# Altium project BMS Slave V0.1.PrjPcb (part 1 of 3)
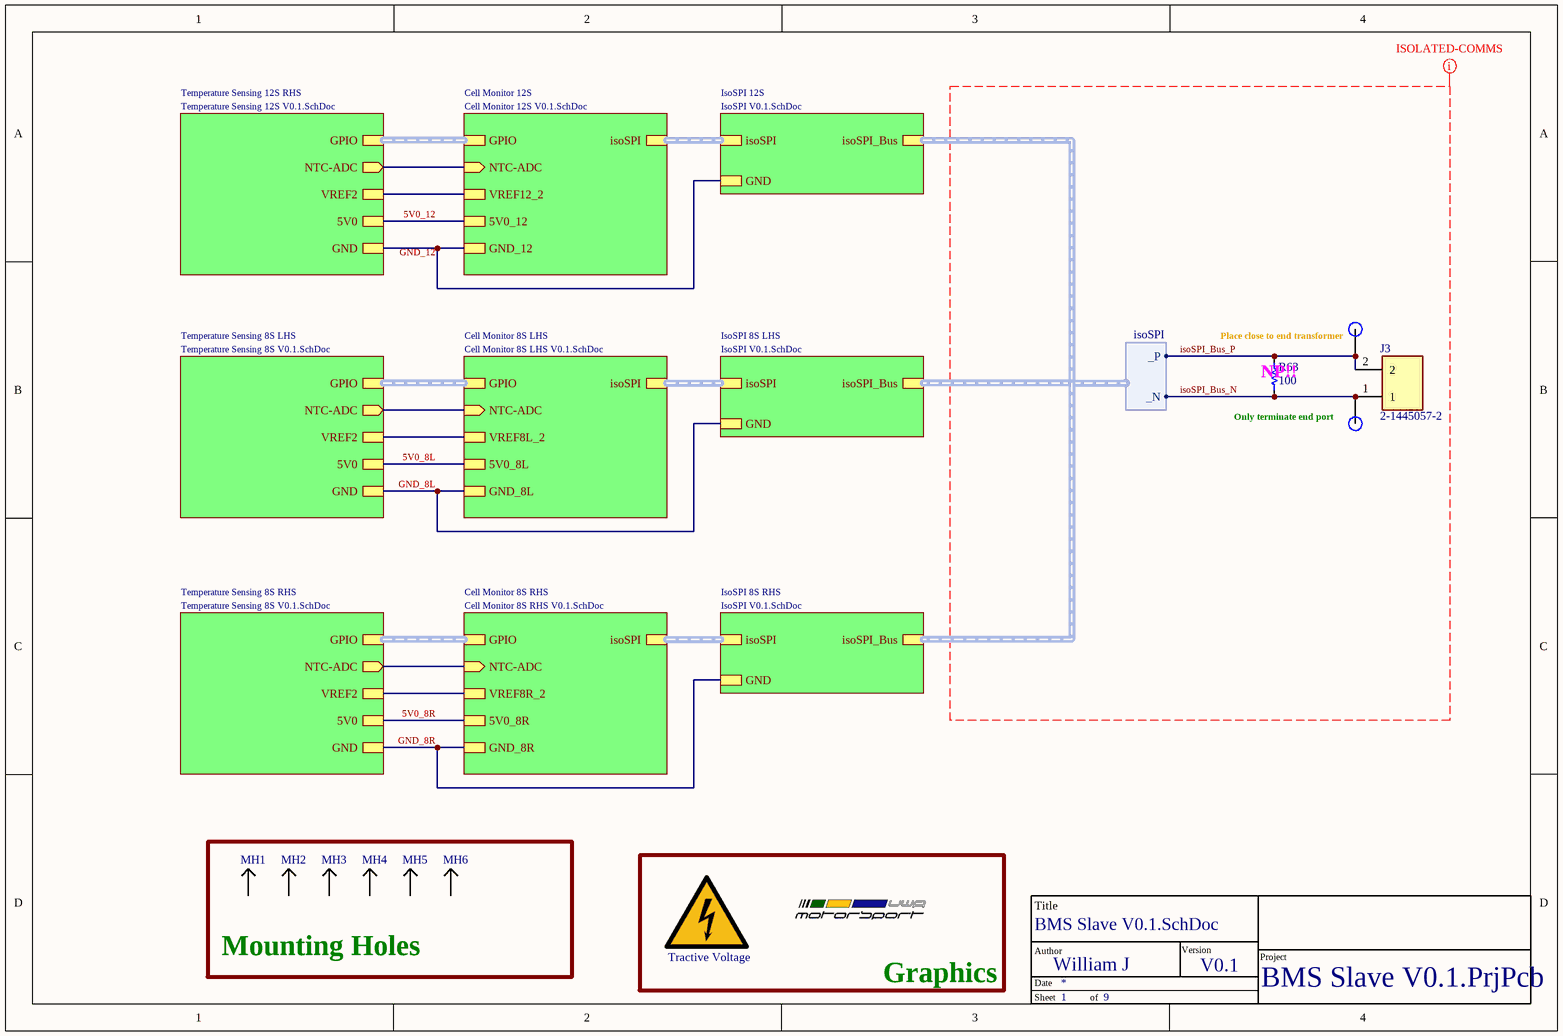
[diagram p0: BMS Slave V0.1.SchDoc]
ProAuthor: William J; ProjectTitle: HV BMS Slave; Version: V0.1
9 sheets, 600 parts. Net scope: strictly hierarchical (ports join the sheet entries above them; power ports are local).
Board file: BMS Slave V0.1.PcbDoc
Sheets:
  BMS Slave V0.1.SchDoc
    Cell Monitor 12S = Cell Monitor 12S V0.1.SchDoc
      Balance Circuit 121 = Balance V0.1.SchDoc
      Balance Circuit 122 = Balance V0.1.SchDoc
      Balance Circuit 123 = Balance V0.1.SchDoc
      Balance Circuit 124 = Balance V0.1.SchDoc
      Balance Circuit 125 = Balance V0.1.SchDoc
      Balance Circuit 126 = Balance V0.1.SchDoc
      Balance Circuit 127 = Balance V0.1.SchDoc
      Balance Circuit 128 = Balance V0.1.SchDoc
      Balance Circuit 129 = Balance V0.1.SchDoc
      Balance Circuit 1210 = Balance V0.1.SchDoc
      Balance Circuit 1211 = Balance V0.1.SchDoc
      Balance Circuit 1212 = Balance V0.1.SchDoc
    IsoSPI 12S = IsoSPI V0.1.SchDoc
    Cell Monitor 8S LHS = Cell Monitor 8S LHS V0.1.SchDoc
      Balance Circuit 8L1 = Balance V0.1.SchDoc
      Balance Circuit 8L2 = Balance V0.1.SchDoc
      Balance Circuit 8L3 = Balance V0.1.SchDoc
      Balance Circuit 8L4 = Balance V0.1.SchDoc
      Balance Circuit 8L5 = Balance V0.1.SchDoc
      Balance Circuit 8L6 = Balance V0.1.SchDoc
      Balance Circuit 8L7 = Balance V0.1.SchDoc
      Balance Circuit 8L8 = Balance V0.1.SchDoc
    Temperature Sensing 8S LHS = Temperature Sensing 8S V0.1.SchDoc
      NTC Sense 8S1 = NTC Sense V0.1.SchDoc
      NTC Sense 8S2 = NTC Sense V0.1.SchDoc
      NTC Sense 8S3 = NTC Sense V0.1.SchDoc
      NTC Sense 8S4 = NTC Sense V0.1.SchDoc
      NTC Sense 8S5 = NTC Sense V0.1.SchDoc
      NTC Sense 8S6 = NTC Sense V0.1.SchDoc
      NTC Sense 8S7 = NTC Sense V0.1.SchDoc
      NTC Sense 8S8 = NTC Sense V0.1.SchDoc
      NTC Sense 8S9 = NTC Sense V0.1.SchDoc
      NTC Sense 8S10 = NTC Sense V0.1.SchDoc
      NTC Sense 8S11 = NTC Sense V0.1.SchDoc
      NTC Sense 8S12 = NTC Sense V0.1.SchDoc
      NTC Sense 8S13 = NTC Sense V0.1.SchDoc
      NTC Sense 8S14 = NTC Sense V0.1.SchDoc
      NTC Sense 8S15 = NTC Sense V0.1.SchDoc
      NTC Sense 8S16 = NTC Sense V0.1.SchDoc
    IsoSPI 8S LHS = IsoSPI V0.1.SchDoc
    Cell Monitor 8S RHS = Cell Monitor 8S RHS V0.1.SchDoc
      Balance Circuit 8R1 = Balance V0.1.SchDoc
      Balance Circuit 8R2 = Balance V0.1.SchDoc
      Balance Circuit 8R3 = Balance V0.1.SchDoc
      Balance Circuit 8R4 = Balance V0.1.SchDoc
      Balance Circuit 8R5 = Balance V0.1.SchDoc
      Balance Circuit 8R6 = Balance V0.1.SchDoc
      Balance Circuit 8R7 = Balance V0.1.SchDoc
      Balance Circuit 8R8 = Balance V0.1.SchDoc
    Temperature Sensing 8S RHS = Temperature Sensing 8S V0.1.SchDoc
      NTC Sense 8S1 = NTC Sense V0.1.SchDoc
      NTC Sense 8S2 = NTC Sense V0.1.SchDoc
      NTC Sense 8S3 = NTC Sense V0.1.SchDoc
      NTC Sense 8S4 = NTC Sense V0.1.SchDoc
      NTC Sense 8S5 = NTC Sense V0.1.SchDoc
      NTC Sense 8S6 = NTC Sense V0.1.SchDoc
      NTC Sense 8S7 = NTC Sense V0.1.SchDoc
      NTC Sense 8S8 = NTC Sense V0.1.SchDoc
      NTC Sense 8S9 = NTC Sense V0.1.SchDoc
      NTC Sense 8S10 = NTC Sense V0.1.SchDoc
      NTC Sense 8S11 = NTC Sense V0.1.SchDoc
      NTC Sense 8S12 = NTC Sense V0.1.SchDoc
      NTC Sense 8S13 = NTC Sense V0.1.SchDoc
      NTC Sense 8S14 = NTC Sense V0.1.SchDoc
      NTC Sense 8S15 = NTC Sense V0.1.SchDoc
      NTC Sense 8S16 = NTC Sense V0.1.SchDoc
    IsoSPI 8S RHS = IsoSPI V0.1.SchDoc
    Temperature Sensing 12S RHS = Temperature Sensing 12S V0.1.SchDoc
      NTC Sense 12S1 = NTC Sense V0.1.SchDoc
      NTC Sense 12S2 = NTC Sense V0.1.SchDoc
      NTC Sense 12S3 = NTC Sense V0.1.SchDoc
      NTC Sense 12S4 = NTC Sense V0.1.SchDoc
      NTC Sense 12S5 = NTC Sense V0.1.SchDoc
      NTC Sense 12S6 = NTC Sense V0.1.SchDoc
      NTC Sense 12S7 = NTC Sense V0.1.SchDoc
      NTC Sense 12S8 = NTC Sense V0.1.SchDoc
      NTC Sense 12S9 = NTC Sense V0.1.SchDoc
      NTC Sense 12S10 = NTC Sense V0.1.SchDoc
      NTC Sense 12S11 = NTC Sense V0.1.SchDoc
      NTC Sense 12S12 = NTC Sense V0.1.SchDoc

## Sheet BMS Slave V0.1.SchDoc
size A4; SheetNumber: 1; SheetTotal: 9

### Parts
(Parts that share a designator on the sheet are numbered #1, #2 ... from top to bottom, then left to right.)
*#1  UWAM Logo  [UWAM Logo]  (value not drawn)  (graphical)
*#2  TitleBlock  (value not drawn)  (graphical)
aaa1  Tractive voltage symbol  [Tractive voltage]  (value not drawn)  (no BOM)
J3  2-1445057-2  [TE_2-1445057-2]
MH1  M3 Mounting Hole  [M3 MH]  (value not drawn)  (no BOM)
MH2  M3 Mounting Hole  [M3 MH]  (value not drawn)  (no BOM)
MH3  M3 Mounting Hole  [M3 MH]  (value not drawn)  (no BOM)
MH4  M3 Mounting Hole  [M3 MH]  (value not drawn)  (no BOM)
MH5  M3 Mounting Hole  [M3 MH]  (value not drawn)  (no BOM)
MH6  M3 Mounting Hole  [M3 MH]  (value not drawn)  (no BOM)
R63  value 100  [R_0402]  (hidden comment: RC0402FR-07100RL)
TP6  IPA  [Test Point]  (value not drawn)  (no BOM)
TP7  IMA  [Test Point]  (value not drawn)  (no BOM)

### Blocks framed on the sheet
Mounting Holes: MH1-MH6
Graphics: *#1 aaa1

### Sub-sheets
Cell Monitor 8S LHS = Cell Monitor 8S LHS V0.1.SchDoc: GPIO (harness GPIO), isoSPI (harness isoSPI), VREF8L_2, NTC-ADC (in), 5V0_8L, GND_8L
Cell Monitor 8S RHS = Cell Monitor 8S RHS V0.1.SchDoc: GPIO (harness GPIO), isoSPI (harness isoSPI), VREF8R_2, NTC-ADC (in), 5V0_8R, GND_8R
Cell Monitor 12S = Cell Monitor 12S V0.1.SchDoc: GPIO (harness GPIO), isoSPI (harness isoSPI), VREF12_2, NTC-ADC (in), 5V0_12, GND_12
IsoSPI 8S LHS = IsoSPI V0.1.SchDoc: isoSPI (harness isoSPI), isoSPI_Bus (harness isoSPI), GND
IsoSPI 8S RHS = IsoSPI V0.1.SchDoc: isoSPI (harness isoSPI), isoSPI_Bus (harness isoSPI), GND
IsoSPI 12S = IsoSPI V0.1.SchDoc: isoSPI (harness isoSPI), isoSPI_Bus (harness isoSPI), GND
Temperature Sensing 8S LHS = Temperature Sensing 8S V0.1.SchDoc: GPIO (harness GPIO), NTC-ADC (out), VREF2, 5V0, GND
Temperature Sensing 8S RHS = Temperature Sensing 8S V0.1.SchDoc: GPIO (harness GPIO), NTC-ADC (out), VREF2, 5V0, GND
Temperature Sensing 12S RHS = Temperature Sensing 12S V0.1.SchDoc: GPIO (harness GPIO), NTC-ADC (out), VREF2, 5V0, GND

### Harnesses
isoSPI: _P, _N

### Nets
5V0_8L: sheet Cell Monitor 8S LHS/5V0_8L, sheet Temperature Sensing 8S LHS/5V0
5V0_8R: sheet Cell Monitor 8S RHS/5V0_8R, sheet Temperature Sensing 8S RHS/5V0
5V0_12: sheet Cell Monitor 12S/5V0_12, sheet Temperature Sensing 12S RHS/5V0
GND_8L: sheet Cell Monitor 8S LHS/GND_8L, sheet Temperature Sensing 8S LHS/GND, sheet IsoSPI 8S LHS/GND
GND_8R: sheet Cell Monitor 8S RHS/GND_8R, sheet Temperature Sensing 8S RHS/GND, sheet IsoSPI 8S RHS/GND
GND_12: sheet Cell Monitor 12S/GND_12, sheet IsoSPI 12S/GND, sheet Temperature Sensing 12S RHS/GND
VREF8L_2: sheet Cell Monitor 8S LHS/VREF8L_2, sheet Temperature Sensing 8S LHS/VREF2
VREF8R_2: sheet Cell Monitor 8S RHS/VREF8R_2, sheet Temperature Sensing 8S RHS/VREF2
VREF12_2: sheet Cell Monitor 12S/VREF12_2, sheet Temperature Sensing 12S RHS/VREF2
isoSPI_Bus_N: J3.1 R63.1 TP7.1 ; sheet IsoSPI 12S/isoSPI_Bus._N
isoSPI_Bus_P: J3.2 R63.2 TP6.1 ; sheet IsoSPI 12S/isoSPI_Bus._P
NetU1_33: sheet Cell Monitor 12S/NTC-ADC, sheet Temperature Sensing 12S RHS/NTC-ADC
NetU2_Temperature_Sensing_8S_LHS_1: sheet Cell Monitor 8S LHS/NTC-ADC, sheet Temperature Sensing 8S LHS/NTC-ADC
NetU2_Temperature_Sensing_8S_RHS_1: sheet Cell Monitor 8S RHS/NTC-ADC, sheet Temperature Sensing 8S RHS/NTC-ADC

Not connected (* = marked no-connect by the designer): MH1 1; MH2 1; MH3 1; MH4 1; MH5 1; MH6 1

### Buses and harness runs
harness sheet Cell Monitor 8S LHS/GPIO = sheet Temperature Sensing 8S LHS/GPIO
harness sheet Cell Monitor 8S LHS/isoSPI = sheet IsoSPI 8S LHS/isoSPI
harness sheet Cell Monitor 8S RHS/GPIO = sheet Temperature Sensing 8S RHS/GPIO
harness sheet Cell Monitor 8S RHS/isoSPI = sheet IsoSPI 8S RHS/isoSPI
harness sheet Cell Monitor 12S/GPIO = sheet Temperature Sensing 12S RHS/GPIO
harness sheet Cell Monitor 12S/isoSPI = sheet IsoSPI 12S/isoSPI
harness sheet IsoSPI 8S LHS/isoSPI_Bus = sheet IsoSPI 8S RHS/isoSPI_Bus = sheet IsoSPI 12S/isoSPI_Bus

### Layout directives
net class IsoComms: isoSPI_Bus_N, isoSPI_Bus_P

### Notes on the sheet
- (near TP6) Place close to end transformer
- (near R63) NP!!
- Only terminate end port
- (in symbol TitleBlock) Title; Author; Version; Project; Date; Sheet; of
- (in symbol Tractive voltage symbol) Tractive Voltage

### Library data of the parts
J3 = 2-1445057-2: CONN HEADER 3MM 2POS R/A TIN SMD; Manufacturer 1: TE Connectivity; MF: {'manufacturer': u'TE Connectivity'}; Package: None; MP: 2-1445057-2; Availability: Unavailable; Price: None; Supplier 1: Mouser; Supplier Part Number 1: 571-2-1445057-2; Manufacturer Part Number 1: 2-1445057-2
R63 = Resistor
TP6 TP7 = Test Point: 1.2mm Test point

## Sheet Cell Monitor 12S V0.1.SchDoc
size A4; SheetNumber: 2; SheetTotal: 9
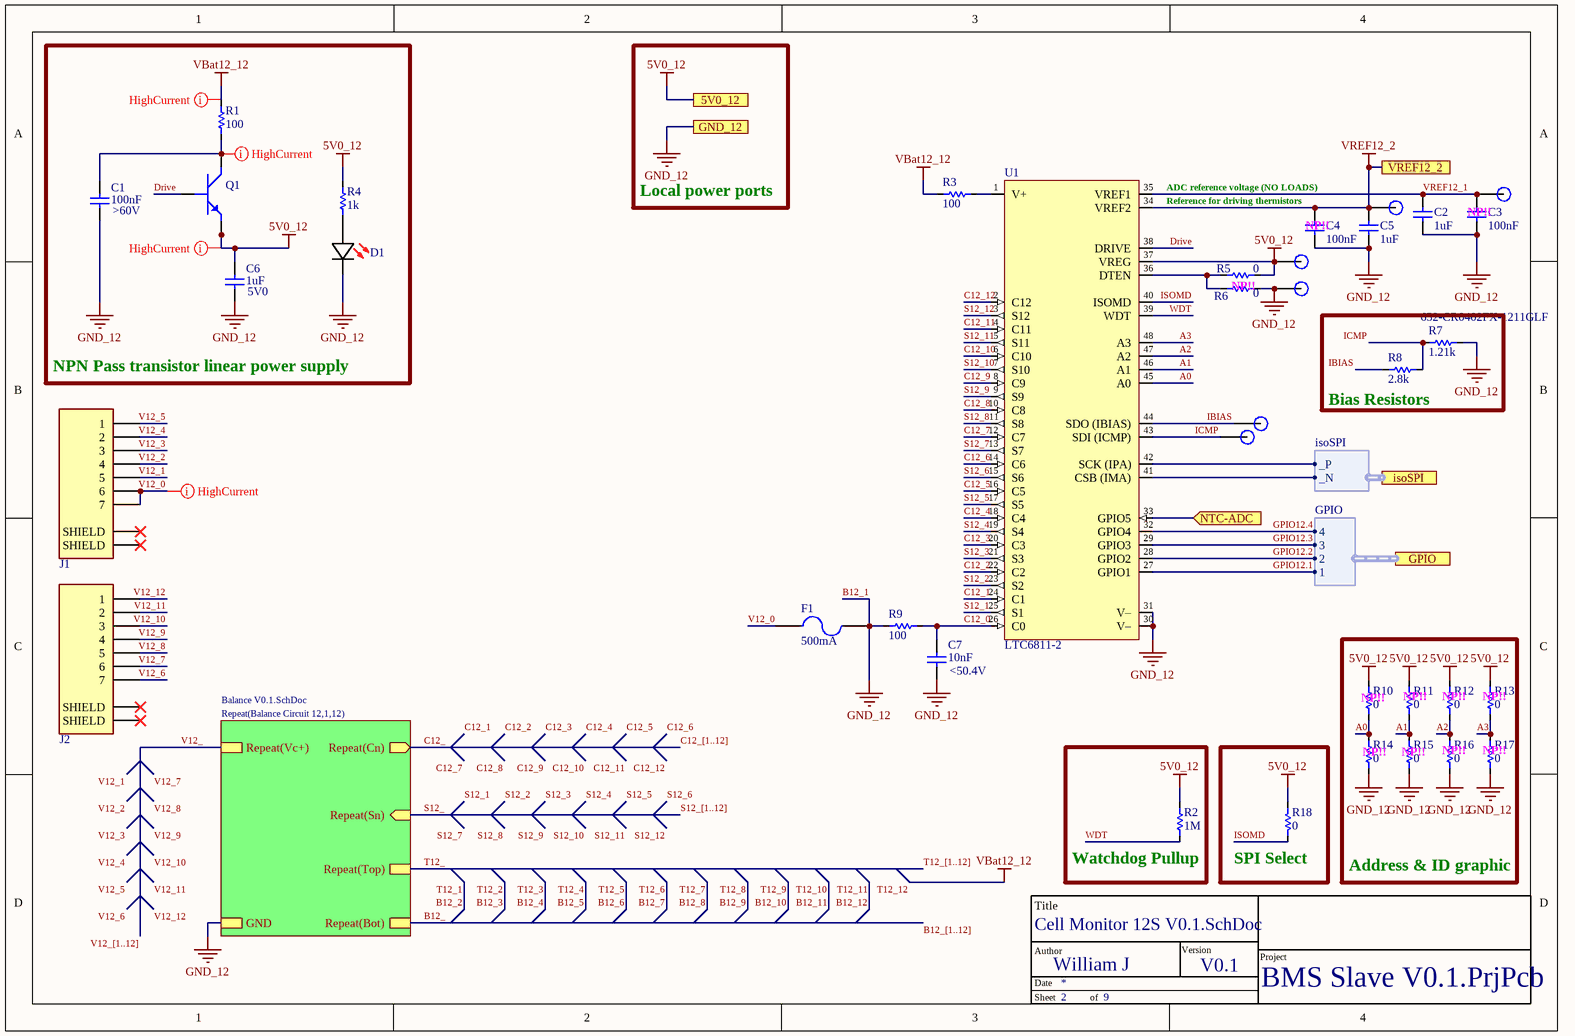
[diagram p1: Cell Monitor 12S V0.1.SchDoc]

### Parts
(Parts that share a designator on the sheet are numbered #1, #2 ... from top to bottom, then left to right.)
*#3  TitleBlock  (value not drawn)  (graphical)
C1  value 100nF  Voltage: >60V  [C_0402]  (hidden comment: GRM155R62A104KE14D)
C2  value 1uF  [C_0402]  (hidden comment: EMK105BJ105KV-F)
C3  value 100nF  [C_0402]  (hidden comment: GRM155R62A104KE14D)
C4  value 100nF  [C_0402]  (hidden comment: GRM155R62A104KE14D)
C5  value 1uF  [C_0402]  (hidden comment: EMK105BJ105KV-F)
C6  value 1uF  Voltage: 5V0  [C_0402]  (hidden comment: EMK105BJ105KV-F)
C7  value 10nF  Voltage: <50.4V  [C_0402]  (hidden comment: C1005X7S2A103K050BB)
D1  150060SS55040  [LED (0603)]  (value not drawn)
F1  Current Rating: 500mA  [0466.500NR]  (hidden comment: 0466.500NR)
J1  84953-7  [84953-7]  (value not drawn)
J2  84953-7  [84953-7]  (value not drawn)
NT1  NetTie  [NetTie]  (value not drawn)  (net tie, no BOM)
NT2  NetTie  [NetTie]  (value not drawn)  (net tie, no BOM)
Q1  PHPT60603NYX  [LFPAK56 (SOT669)]  (value not drawn)
R1  value 100  [R_2010]  (hidden comment: CRM2010-FX-1000ELF)
R2  value 1M  [R_0402]  (hidden comment: RC0402JR-071ML)
R3  value 100  [R_2010]  (hidden comment: CRM2010-FX-1000ELF)
R4  value 1k  [R_0402]  (hidden comment: RC0402FR-071KL)
R5  value 0  [R_0402]  (hidden comment: CR0402-J/-000GLF)
R6  value 0  [R_0402]  (hidden comment: CR0402-J/-000GLF)
R7  value 1.21k  Supplier Part Number 1: 652-CR0402FX-1211GLF  [R_0402]  (hidden comment: CR0402-FX-1211GLF)
R8  value 2.8k  [R_0402]  (hidden comment: ERJ-2RKF2801X)
R9  value 100  [R_0402]  (hidden comment: RC0402FR-07100RL)
R10  value 0  [R_0402]  (hidden comment: CR0402-J/-000GLF)
R11  value 0  [R_0402]  (hidden comment: CR0402-J/-000GLF)
R12  value 0  [R_0402]  (hidden comment: CR0402-J/-000GLF)
R13  value 0  [R_0402]  (hidden comment: CR0402-J/-000GLF)
R14  value 0  [R_0402]  (hidden comment: CR0402-J/-000GLF)
R15  value 0  [R_0402]  (hidden comment: CR0402-J/-000GLF)
R16  value 0  [R_0402]  (hidden comment: CR0402-J/-000GLF)
R17  value 0  [R_0402]  (hidden comment: CR0402-J/-000GLF)
R18  value 0  [R_0402]  (hidden comment: CR0402-J/-000GLF)
TP1  VREF1  [Test Point]  (value not drawn)  (no BOM)
TP2  VREF2  [Test Point]  (value not drawn)  (no BOM)
TP3  5V0_12  [Test Point]  (value not drawn)  (no BOM)
TP4  IBIAS  [Test Point]  (value not drawn)  (no BOM)
TP5  ICMP  [Test Point]  (value not drawn)  (no BOM)
TP13  5V0_8R  [Test Point]  (value not drawn)  (no BOM)
U1  LTC6811-2  [SSOP50P780X200-48N]

### Blocks framed on the sheet
NPN Pass transistor linear power supply: C1 C6 D1 Q1 R1 R4
Bias Resistors: R7 R8
Address & ID graphic: R10-R17
Watchdog Pullup: R2
SPI Select: R18

### Sub-sheets
Repeat(Balance Circuit 12,1,12) = Balance V0.1.SchDoc: Repeat(Bot), Repeat(Vc+), Repeat(Top), Repeat(Cn) (out), Repeat(Sn) (in), GND

### Ports
5V0_12, GND_12, GPIO (harness GPIO), isoSPI (harness isoSPI), NTC-ADC (in), VREF12_2

### Harnesses
GPIO: 1, 2, 3, 4
isoSPI: _P, _N

### Nets
5V0_12: C6.2 Q1.1(Emitter) Q1.2(Emitter) Q1.3(Emitter) R2.2 R4.2 R5.2 R10.2 R11.2 R12.2 R13.2 R18.2 TP3.1 U1.37(VREG) ; port 5V0_12
GND_12: C1.1 C2.1 C3.1 C4.1 C5.1 C6.1 C7.1 D1.1(K) F1.2 NT1.1 R6.1 R7.2 R9.1 R14.1 R15.1 R16.1 R17.1 TP13.1 U1.30(V–) U1.31(V–) ; port GND_12, sheet Repeat(Balance Circuit 12,1,12)/GND
VBat12_12: NT2.2 R1.2 R3.2
VREF12_2: C4.2 C5.2 TP2.1 U1.34(VREF2) ; port VREF12_2
A0: R10.1 R14.2 U1.45(A0)  [project net A0_2]
A1: R11.1 R15.2 U1.46(A1)  [project net A1_2]
A2: R12.1 R16.2 U1.47(A2)  [project net A2_2]
A3: R13.1 R17.2 U1.48(A3)  [project net A3_2]
B12_: sheet Repeat(Balance Circuit 12,1,12)/Repeat(Bot)
B12_1: NT1.2
C12_: sheet Repeat(Balance Circuit 12,1,12)/Repeat(Cn)
C12_0: C7.2 R9.2 U1.26(C0)  [project net C12_0_2]
C12_1: U1.24(C1)
C12_2: U1.22(C2)
C12_3: U1.20(C3)
C12_4: U1.18(C4)
C12_5: U1.16(C5)
C12_6: U1.14(C6)
C12_7: U1.12(C7)
C12_8: U1.10(C8)
C12_9: U1.8(C9)
C12_10: U1.6(C10)
C12_11: U1.4(C11)
C12_12: U1.2(C12)
Drive: Q1.4(Base) U1.38(DRIVE)  [project net Drive_2]
GPIO12.1: U1.27(GPIO1) ; port GPIO.1
GPIO12.2: U1.28(GPIO2) ; port GPIO.2
GPIO12.3: U1.29(GPIO3) ; port GPIO.3
GPIO12.4: U1.32(GPIO4) ; port GPIO.4
IBIAS: R8.1 TP4.1 U1.44(SDO_(IBIAS))  [project net IBIAS_2]
ICMP: R7.1 R8.2 TP5.1 U1.43(SDI_(ICMP))  [project net ICMP_2]
ISOMD: R18.1 U1.40(ISOMD)  [project net ISOMD_2]
isoSPI._N: U1.41(CSB_(IMA)) ; port isoSPI._N
isoSPI._P: U1.42(SCK_(IPA)) ; port isoSPI._P
S12_: sheet Repeat(Balance Circuit 12,1,12)/Repeat(Sn)
S12_1: U1.25(S1)
S12_2: U1.23(S2)
S12_3: U1.21(S3)
S12_4: U1.19(S4)
S12_5: U1.17(S5)
S12_6: U1.15(S6)
S12_7: U1.13(S7)
S12_8: U1.11(S8)
S12_9: U1.9(S9)
S12_10: U1.7(S10)
S12_11: U1.5(S11)
S12_12: U1.3(S12)
T12_: sheet Repeat(Balance Circuit 12,1,12)/Repeat(Top)
T12_12: NT2.1
V12_: sheet Repeat(Balance Circuit 12,1,12)/Repeat(Vc+)
V12_0: F1.1 J1.6 J1.7  [project net V12_0_2]
V12_1: J1.5
V12_2: J1.4
V12_3: J1.3
V12_4: J1.2
V12_5: J1.1
V12_6: J2.7
V12_7: J2.6
V12_8: J2.5
V12_9: J2.4
V12_10: J2.3
V12_11: J2.2
V12_12: J2.1
VREF12_1: C2.2 C3.2 TP1.1 U1.35(VREF1)  [project net VREF12_1_2]
WDT: R2.1 U1.39(WDT)  [project net WDT_2]
NetC1_2: C1.2 Q1.5(Collector) R1.1
NetD1_2: D1.2(A) R4.1
NetR3_1: R3.1 U1.1(V+)
NetR5_1: R5.1 R6.2 U1.36(DTEN)
NetU1_33: U1.33(GPIO5) ; port NTC-ADC

Not connected (* = marked no-connect by the designer): J1 S1(SHIELD)* S2(SHIELD)*; J2 S1(SHIELD)* S2(SHIELD)*

### Buses and harness runs
bus B12_[1..12]
bus C12_[1..12]
bus S12_[1..12]
bus T12_[1..12]
bus V12_[1..12]

### Layout directives
net class HighCurrent; Current: >50mA: 5V0_12, NetC1_2, V12_0_2, VBat12_12

### Notes on the sheet
- Local power ports
- ADC reference voltage (NO LOADS)
- (near C4) Reference for driving thermistors
- (near C4) NP!!
- (near C3) NP!!
- (near R6) NP!!
- (near R10) NP!!
- (near R11) NP!!
- (near R12) NP!!
- (near R13) NP!!
- (near R14) NP!!
- (near R15) NP!!
- (near R16) NP!!
- (near R17) NP!!
- Labels drawn without touching a wire or pin: C12_1, C12_2, C12_3, C12_4, C12_5, C12_6, C12_7, C12_8, C12_9, C12_10, C12_11, C12_12, S12_1, S12_2, S12_3, S12_4, S12_5, S12_6, S12_7, S12_8, S12_9, S12_10, S12_11, S12_12, V12_1, V12_2, V12_3, V12_4, V12_5, V12_6, V12_7, V12_8, V12_9, V12_10, V12_11, V12_12
- (in symbol TitleBlock) Title; Author; Version; Project; Date; Sheet; of

### Library data of the parts
C1-C7 = Capacitor: ComponentLink1Description: New link; ComponentLink1URL: *
  C1 C3 C4: Manufacture Part Number 1: GRM155R62A104KE14D
D1 = 150060SS55040: LED RED DIFFUSED 0603 SMD; Manufacturer: Wurth Electronics; Lens Style: Flat; Luminous Intensity: 70mcd; Forward Voltage: 2V; Test Current: 20mA; Viewing Angle: 140°; Dominant Wavelength: 630nm; Lens Size: 0.8mm; Supplier 1: Mouser; Manufacturer Part Number: 150060SS55040; RoHS: No; Category: LEDs; Stock 1: 17006; Pricing 1: 1=0.18000, 10=0.16800, 50=0.16800, 100=0.15200, 1000=0.12100, 10000=0.10600 (USD); Mount: Surface Mount; Case/Package: 0603; Color: Red; Case Code (Imperial): 0603; Case Code (Metric): 1608; Packaging: Tape and Reel; Lens Transparency: Diffused; Length: 1.6mm; Width: 0.8mm; Height: 0.5mm; RoHS Compliant: No; Supplier Part Number 1: 710-150060SS55040
F1 = Fuse 2: LITTELFUSE - 0466.500NR - Fuse, Surface Mount, 500 mA, 466 Series, 63 VAC, 63 VDC, Very Fast Acting, 1206; Body Material: Thermoplastic; Voltage Rating (AC): 63V; Resistance: 350mR; DC Cold Resistance: 248mR; Fuse Type: Board Mount (Cartridge Style Excluded); Approvals: UL,CSA; Published: 8-Jun-2000; LatestRevisionDate: 17-Jul-2002; LatestRevisionNote: Re-released for DXP Platform.; PackageReference: PIN-W2/E2.8; Publisher: Altium Limited; PackageDescription: Thru-Hole; 2 Leads; Supplier 1: Mouser; Supplier Part Number 1: 576-0466.500NR; Manufacturer: Littelfuse; Manufacturer Part Number: 0466.500NR; RoHS: Yes; Category: Fuses; Stock 1: 36497; Pricing 1: 1=0.77000, 10=0.59200, 50=0.59200, 100=0.48900, 1000=0.41600, 10000=0.39000 (USD); Mount: Surface Mount; Case/Package: 1206; Number of Pins: 2; Case Code (Metric): 3216; Case Code (Imperial): 1206; Housing Material: Ceramic; Terminal Material: Copper; Min Operating Temperature: -55°C; Max Operating Temperature: 90°C; Packaging: Tape and Reel; Package Quantity: 5000; Voltage Rating (DC): 63V; Series: 466; Voltage Rating: 63V; Termination: SMD/SMT; Fuse Current: 500mA; Working Voltage: 63V; Length: 3.18mm; Width: 0.06inch; Height: 0.023inch; Depth: 1.52mm; Radiation Hardening: No; RoHS Compliant: Yes; REACH SVHC: Unknown; Lead Free: Lead Free; ComponentLink1URL: https://datasheet.ciiva.com/17081/0466-500nr-17081083.pdf?src-supplier=Allied+Electronics; ComponentLink1Description: https://datasheet.ciiva.com/17081/0466-500nr-17081083.pdf?src-supplier=Allied+Electronics; ComponentLink2URL: https://datasheet.ciiva.com/16327/littelfuse-fuse-466-16327478.pdf?src-supplier=Future+Electronics; ComponentLink2Description: https://datasheet.ciiva.com/16327/littelfuse-fuse-466-16327478.pdf?src-supplier=Future+Electronics; ComponentLink3URL: https://datasheet.ciiva.com/299/466seriesdrawing-299207.pdf?src-supplier=Digi-Key; ComponentLink3Description: https://datasheet.ciiva.com/299/466seriesdrawing-299207.pdf?src-supplier=Digi-Key; ComponentLink4URL: https://datasheet.ciiva.com/299/466seriesdrawing-299208.pdf?src-supplier=Digi-Key; ComponentLink4Description: https://datasheet.ciiva.com/299/466seriesdrawing-299208.pdf?src-supplier=Digi-Key; ComponentLink5URL: https://datasheet.ciiva.com/299/466seriesdrawing-299209.pdf?src-supplier=Digi-Key; ComponentLink5Description: https://datasheet.ciiva.com/299/466seriesdrawing-299209.pdf?src-supplier=Digi-Key; ComponentLink6URL: https://datasheet.ciiva.com/14102/ei466-dat-e-14102891.pdf?src-supplier=Distrelec; ComponentLink6Description: https://datasheet.ciiva.com/14102/ei466-dat-e-14102891.pdf?src-supplier=Distrelec; ComponentLink7URL: https://datasheet.ciiva.com/15186/getdatasheetpartid-57351-15186924.pdf?src-supplier=Verical; ComponentLink7Description: https://datasheet.ciiva.com/15186/getdatasheetpartid-57351-15186924.pdf?src-supplier=Verical
J1 J2 = 84953-7: FPC Connectors, Flex-to-Board, 7 Position, .039 in [1 mm] Centerline, Zero Insertion Force (ZIF), Right Angle, Surface Mount; Manufacturer: TE Connectivity; Current Rating: 1A; Number of Contacts: 7; Shielding: Unshielded; Gender: Female; Voltage Rating: 200V; Connector Type: Receptacle,Connector,Socket; Wire/Cable Type: Flat Flex; Mating Alignment: Yes (With); PCB Mount Alignment: No (Without); PCB Mount Retention: With; Contact Location: Top; Pitch: 0.039inch; Plating Thickness: 2um; Supplier 1: Mouser; Manufacturer Part Number: 84953-7; RoHS: Yes; Category: FFC / FPC; Pricing 1: 1=0.96000, 10=0.78800, 50=0.78800, 100=0.68800, 500=0.59100, 1000=0.52600, 1500=0.47600, 4500=0.45900, 9000=0.43600, 10000=0.43600, 24000=0.42600 (USD); Mount: Surface Mount; Contact Material: Bronze; Contact Plating: Tin,Bright; Housing Color: Natural; Housing Material: Polymer; Min Operating Temperature: -40°C; Max Operating Temperature: 85°C; Termination: SMD/SMT; Package Quantity: 1500; Number of Rows: 1; Packaging: Tape and Reel; Orientation: Right Angle; Number of Positions: 7; Connector System: Flex-to-Board; PCB Mounting Orientation: Right Angle; Sealable: No (Without); Shrouded: Yes (With); Contact Current Rating: 1A; Max Voltage Rating (AC): 200V; Series: FPC; Length: 0.5866inch; Width: 0.2575inch; Height: 2.56mm; Depth: 7.3mm; Radiation Hardening: No; ELV: Compliant; REACH SVHC: Unknown; Flammability Rating: UL94 V-0; RoHS Compliant: Yes; ComponentLink1URL: https://datasheet.ciiva.com/669/eng-cd-84953-a3-669227.pdf?src-supplier=Digi-Key; ComponentLink1Description: https://datasheet.ciiva.com/669/eng-cd-84953-a3-669227.pdf?src-supplier=Digi-Key; ComponentLink2URL: https://datasheet.ciiva.com/669/eng-cd-84953-a3-669228.pdf?src-supplier=Digi-Key; ComponentLink2Description: https://datasheet.ciiva.com/669/eng-cd-84953-a3-669228.pdf?src-supplier=Digi-Key; ComponentLink3URL: https://datasheet.ciiva.com/30243/eng-ds-1-1773440-6-0506-30243340.pdf?src-supplier=Onlinecomponents.com; ComponentLink3Description: https://datasheet.ciiva.com/30243/eng-ds-1-1773440-6-0506-30243340.pdf?src-supplier=Onlinecomponents.com; ComponentLink4URL: https://datasheet.ciiva.com/16659/eng-ds-1-1773440-6-0506-16659033.pdf?src-supplier=Avnet+Europe; ComponentLink4Description: https://datasheet.ciiva.com/16659/eng-ds-1-1773440-6-0506-16659033.pdf?src-supplier=Avnet+Europe; ComponentLink5URL: https://datasheet.ciiva.com/669/eng-cd-84953-a3-669226.pdf?src-supplier=Digi-Key; ComponentLink5Description: https://datasheet.ciiva.com/669/eng-cd-84953-a3-669226.pdf?src-supplier=Digi-Key; ComponentLink6URL: https://datasheet.ciiva.com/15177/getdatasheetpartid-565061-15177031.pdf?src-supplier=Verical; ComponentLink6Description: https://datasheet.ciiva.com/15177/getdatasheetpartid-565061-15177031.pdf?src-supplier=Verical; ComponentLink7URL: https://datasheet.ciiva.com/10034/eng-ds-1-1773440-6-0506-10034350.pdf?src-supplier=Avnet; ComponentLink7Description: https://datasheet.ciiva.com/10034/eng-ds-1-1773440-6-0506-10034350.pdf?src-supplier=Avnet; Supplier Part Number 1: 571-84953-7
Q1 = PHPT60603NYX: 60V, 3 A NPN high power bipolar transistor
R1-R18 = Resistor
  R7: Supplier 1: Mouser
TP1-TP5 TP13 = Test Point: 1.2mm Test point
U1 = LTC6811-2: 12 Channel Multicell Battery Monitor with Addressable Interface

## Sheet Balance V0.1.SchDoc
size A4; SheetNumber: 3; SheetTotal: 9
Used 28 times, as channels Cell Monitor 12S/Balance Circuit 121, Cell Monitor 12S/Balance Circuit 122, Cell Monitor 12S/Balance Circuit 123, Cell Monitor 12S/Balance Circuit 124, Cell Monitor 12S/Balance Circuit 125, Cell Monitor 12S/Balance Circuit 126, Cell Monitor 12S/Balance Circuit 127, Cell Monitor 12S/Balance Circuit 128, Cell Monitor 12S/Balance Circuit 129, Cell Monitor 12S/Balance Circuit 1210, Cell Monitor 12S/Balance Circuit 1211, Cell Monitor 12S/Balance Circuit 1212, Cell Monitor 8S LHS/Balance Circuit 8L1, Cell Monitor 8S LHS/Balance Circuit 8L2, Cell Monitor 8S LHS/Balance Circuit 8L3, Cell Monitor 8S LHS/Balance Circuit 8L4, Cell Monitor 8S LHS/Balance Circuit 8L5, Cell Monitor 8S LHS/Balance Circuit 8L6, Cell Monitor 8S LHS/Balance Circuit 8L7, Cell Monitor 8S LHS/Balance Circuit 8L8, Cell Monitor 8S RHS/Balance Circuit 8R1, Cell Monitor 8S RHS/Balance Circuit 8R2, Cell Monitor 8S RHS/Balance Circuit 8R3, Cell Monitor 8S RHS/Balance Circuit 8R4, Cell Monitor 8S RHS/Balance Circuit 8R5, Cell Monitor 8S RHS/Balance Circuit 8R6, Cell Monitor 8S RHS/Balance Circuit 8R7, Cell Monitor 8S RHS/Balance Circuit 8R8. Parts and nets are listed once, with the designators drawn on the sheet.
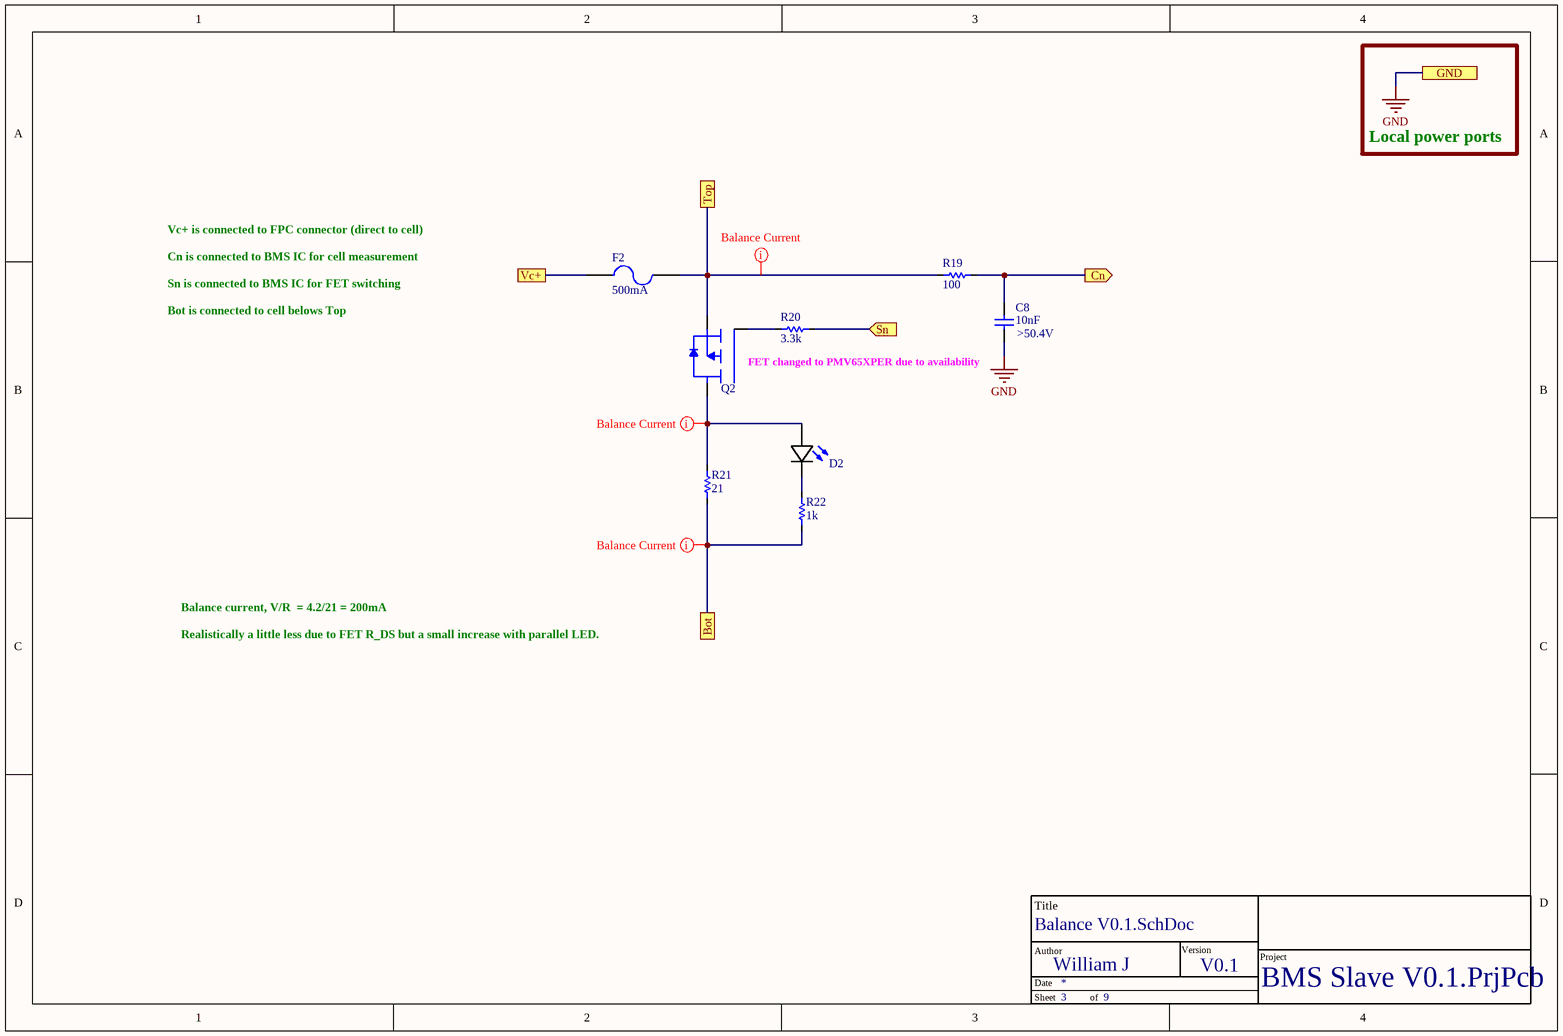
[diagram p2: Balance V0.1.SchDoc]

### Parts
*  TitleBlock  (value not drawn)  (graphical)
C8  value 10nF  Voltage: >50.4V  [C_0402]  (hidden comment: C1005X7S2A103K050BB)
D2  150060BS55040  [LED (0603)]  (value not drawn)
F2  Current Rating: 500mA  [0466.500NR]  (hidden comment: 0466.500NR)
Q2  NX2301PVL  [SOT95P230X110-3N]  (value not drawn)
R19  value 100  [R_0402]  (hidden comment: RC0402FR-07100RL)
R20  value 3.3k  [R_0402]  (hidden comment: AC0402FR-073K3L)
R21  value 21  [R_2512]  (hidden comment: CRM2512-JW-220ELF)
R22  value 1k  [R_0402]  (hidden comment: RC0402FR-071KL)

### Ports
Bot, Cn (out), GND, Sn (in), Top, Vc+

### Nets
GND: C8.1 ; port GND
Bot: R21.1 R22.1 ; port Bot
Cn: C8.2 R19.2 ; port Cn
Sn: R20.2 ; port Sn
Top: F2.2 Q2.2(Source) R19.1 ; port Top
Vc+: F2.1 ; port Vc+
NetD2_1: D2.1(K) R22.2
NetD2_2: D2.2(A) Q2.3(Drain) R21.2
NetQ2_1: Q2.1(Base) R20.1

### Channels
Cell Monitor 12S/Balance Circuit 121: designators end in _Balance_Circuit_121; ports Bot=B12_1 Cn=C12_1 GND=GND_12 Sn=S12_1 Top=B12_2 Vc+=V12_1
Cell Monitor 12S/Balance Circuit 122: designators end in _Balance_Circuit_122; ports Bot=B12_2 Cn=C12_2 GND=GND_12 Sn=S12_2 Top=B12_3 Vc+=V12_2
Cell Monitor 12S/Balance Circuit 123: designators end in _Balance_Circuit_123; ports Bot=B12_3 Cn=C12_3 GND=GND_12 Sn=S12_3 Top=B12_4 Vc+=V12_3
Cell Monitor 12S/Balance Circuit 124: designators end in _Balance_Circuit_124; ports Bot=B12_4 Cn=C12_4 GND=GND_12 Sn=S12_4 Top=B12_5 Vc+=V12_4
Cell Monitor 12S/Balance Circuit 125: designators end in _Balance_Circuit_125; ports Bot=B12_5 Cn=C12_5 GND=GND_12 Sn=S12_5 Top=B12_6 Vc+=V12_5
Cell Monitor 12S/Balance Circuit 126: designators end in _Balance_Circuit_126; ports Bot=B12_6 Cn=C12_6 GND=GND_12 Sn=S12_6 Top=B12_7 Vc+=V12_6
Cell Monitor 12S/Balance Circuit 127: designators end in _Balance_Circuit_127; ports Bot=B12_7 Cn=C12_7 GND=GND_12 Sn=S12_7 Top=B12_8 Vc+=V12_7
Cell Monitor 12S/Balance Circuit 128: designators end in _Balance_Circuit_128; ports Bot=B12_8 Cn=C12_8 GND=GND_12 Sn=S12_8 Top=B12_9 Vc+=V12_8
Cell Monitor 12S/Balance Circuit 129: designators end in _Balance_Circuit_129; ports Bot=B12_9 Cn=C12_9 GND=GND_12 Sn=S12_9 Top=B12_10 Vc+=V12_9
Cell Monitor 12S/Balance Circuit 1210: designators end in _Balance_Circuit_1210; ports Bot=B12_10 Cn=C12_10 GND=GND_12 Sn=S12_10 Top=B12_11 Vc+=V12_10
Cell Monitor 12S/Balance Circuit 1211: designators end in _Balance_Circuit_1211; ports Bot=B12_11 Cn=C12_11 GND=GND_12 Sn=S12_11 Top=B12_12 Vc+=V12_11
Cell Monitor 12S/Balance Circuit 1212: designators end in _Balance_Circuit_1212; ports Bot=B12_12 Cn=C12_12 GND=GND_12 Sn=S12_12 Top=T12_12 Vc+=V12_12
Cell Monitor 8S LHS/Balance Circuit 8L1: designators end in _Balance_Circuit_8L1; ports Bot=B8L_1 Cn=C8L_1 GND=GND_8L Sn=S8L_1 Top=B8L_2 Vc+=V8L_1
Cell Monitor 8S LHS/Balance Circuit 8L2: designators end in _Balance_Circuit_8L2; ports Bot=B8L_2 Cn=C8L_2 GND=GND_8L Sn=S8L_2 Top=B8L_3 Vc+=V8L_2
Cell Monitor 8S LHS/Balance Circuit 8L3: designators end in _Balance_Circuit_8L3; ports Bot=B8L_3 Cn=C8L_3 GND=GND_8L Sn=S8L_3 Top=B8L_4 Vc+=V8L_3
Cell Monitor 8S LHS/Balance Circuit 8L4: designators end in _Balance_Circuit_8L4; ports Bot=B8L_4 Cn=C8L_4 GND=GND_8L Sn=S8L_4 Top=B8L_5 Vc+=V8L_4
Cell Monitor 8S LHS/Balance Circuit 8L5: designators end in _Balance_Circuit_8L5; ports Bot=B8L_5 Cn=C8L_5 GND=GND_8L Sn=S8L_5 Top=B8L_6 Vc+=V8L_5
Cell Monitor 8S LHS/Balance Circuit 8L6: designators end in _Balance_Circuit_8L6; ports Bot=B8L_6 Cn=C8L_6 GND=GND_8L Sn=S8L_6 Top=B8L_7 Vc+=V8L_6
Cell Monitor 8S LHS/Balance Circuit 8L7: designators end in _Balance_Circuit_8L7; ports Bot=B8L_7 Cn=C8L_7 GND=GND_8L Sn=S8L_7 Top=B8L_8 Vc+=V8L_7
Cell Monitor 8S LHS/Balance Circuit 8L8: designators end in _Balance_Circuit_8L8; ports Bot=B8L_8 Cn=C8L_8 GND=GND_8L Sn=S8L_8 Top=T8L_8 Vc+=V8L_8
Cell Monitor 8S RHS/Balance Circuit 8R1: designators end in _Balance_Circuit_8R1; ports Bot=B8R_1 Cn=C8R_1 GND=GND_8R Sn=S8R_1 Top=B8R_2 Vc+=V8R_1
Cell Monitor 8S RHS/Balance Circuit 8R2: designators end in _Balance_Circuit_8R2; ports Bot=B8R_2 Cn=C8R_2 GND=GND_8R Sn=S8R_2 Top=B8R_3 Vc+=V8R_2
Cell Monitor 8S RHS/Balance Circuit 8R3: designators end in _Balance_Circuit_8R3; ports Bot=B8R_3 Cn=C8R_3 GND=GND_8R Sn=S8R_3 Top=B8R_4 Vc+=V8R_3
Cell Monitor 8S RHS/Balance Circuit 8R4: designators end in _Balance_Circuit_8R4; ports Bot=B8R_4 Cn=C8R_4 GND=GND_8R Sn=S8R_4 Top=B8R_5 Vc+=V8R_4
Cell Monitor 8S RHS/Balance Circuit 8R5: designators end in _Balance_Circuit_8R5; ports Bot=B8R_5 Cn=C8R_5 GND=GND_8R Sn=S8R_5 Top=B8R_6 Vc+=V8R_5
Cell Monitor 8S RHS/Balance Circuit 8R6: designators end in _Balance_Circuit_8R6; ports Bot=B8R_6 Cn=C8R_6 GND=GND_8R Sn=S8R_6 Top=B8R_7 Vc+=V8R_6
Cell Monitor 8S RHS/Balance Circuit 8R7: designators end in _Balance_Circuit_8R7; ports Bot=B8R_7 Cn=C8R_7 GND=GND_8R Sn=S8R_7 Top=B8R_8 Vc+=V8R_7
Cell Monitor 8S RHS/Balance Circuit 8R8: designators end in _Balance_Circuit_8R8; ports Bot=B8R_8 Cn=C8R_8 GND=GND_8R Sn=S8R_8 Top=T8R_8 Vc+=V8R_8

### Layout directives
net class BalanceNetClass; Current: 200mA: B12_1, B12_2, NetD2_Balance_Circuit_121_2

### Notes on the sheet
- Local power ports
- Vc+ is connected to FPC connector (direct to cell)
  Cn is connected to BMS IC for cell measurement
  Sn is connected to BMS IC for FET switching
  Bot is connected to cell belows Top
- (near Q2) FET changed to PMV65XPER due to availability
- Balance current, V/R  = 4.2/21 = 200mA
  Realistically a little less due to FET R_DS but a small increase with parallel LED.
- (in symbol TitleBlock) Title; Author; Version; Project; Date; Sheet; of

### Library data of the parts
C8 = Capacitor: ComponentLink1Description: New link; ComponentLink1URL: *
D2 = 150060BS55040: LED BLUE DIFFUSED 0603 SMD; Manufacturer: Wurth Electronics; Lens Style: Flat; Luminous Intensity: 80mcd; Forward Voltage: 3.2V; Test Current: 20mA; Viewing Angle: 140°; Dominant Wavelength: 470nm; Lens Size: 0.8mm; Supplier 1: Mouser; Manufacturer Part Number: 150060BS55040; RoHS: No; Pricing 1: 1=0.18000, 10=0.16800, 50=0.16800, 100=0.15200, 1000=0.12100, 10000=0.10600 (USD); Mount: Surface Mount; Case/Package: 0603; Color: Blue; Packaging: Tape and Reel; Lens Transparency: Diffused; Length: 1.6mm; Width: 0.8mm; Height: 0.5mm; RoHS Compliant: No; ComponentLink1URL: http://www.farnell.com/datasheets/2621640.pdf?src-supplier=Farnell; ComponentLink1Description: http://www.farnell.com/datasheets/2621640.pdf?src-supplier=Farnell; ComponentLink2URL: https://www.we-online.de/web/en/index.php/download/media/07_electronic_components/download_center_1/application_notes_berichte/ano002_leds___the_future_of_horticultural_lighting/ANO002b_EN_LEDs_The_Future_of_Horticultural_Lighting.pdf?src-supplier=Digi-Key; ComponentLink2Description: https://www.we-online.de/web/en/index.php/download/media/07_electronic_components/download_center_1/application_notes_berichte/ano002_leds___the_future_of_horticultural_lighting/ANO002b_EN_LEDs_The_Future_of_Horticultural_Lighting.pdf?src-supplier=Digi-Key; ComponentLink3URL: https://katalog.we-online.de/pbs/datasheet/150060BS55040.pdf?src-supplier=Digi-Key; ComponentLink3Description: https://katalog.we-online.de/pbs/datasheet/150060BS55040.pdf?src-supplier=Digi-Key; ComponentLink4URL: http://www.farnell.com/datasheets/2621640.pdf?src-supplier=Newark; ComponentLink4Description: http://www.farnell.com/datasheets/2621640.pdf?src-supplier=Newark; Supplier Part Number 1: 710-150060BS55040
F2 = Fuse 2: as F1 on sheet Cell Monitor 12S V0.1; Published: 8-Jun-2000; LatestRevisionDate: 17-Jul-2002; LatestRevisionNote: Re-released for DXP Platform.; PackageReference: PIN-W2/E2.8; Publisher: Altium Limited; PackageDescription: Thru-Hole; 2 Leads; Supplier 1: Mouser; Supplier Part Number 1: 576-0466.500NR; Manufacturer: Littelfuse; Manufacturer Part Number: 0466.500NR; RoHS: Yes; Category: Fuses; Stock 1: 36497; Pricing 1: 1=0.77000, 10=0.59200, 50=0.59200, 100=0.48900, 1000=0.41600, 10000=0.39000 (USD); Mount: Surface Mount; Case/Package: 1206; Number of Pins: 2; Case Code (Metric): 3216; Case Code (Imperial): 1206; Housing Material: Ceramic; Terminal Material: Copper; Min Operating Temperature: -55°C; Max Operating Temperature: 90°C; Packaging: Tape and Reel; Package Quantity: 5000; Voltage Rating (DC): 63V; Series: 466; Voltage Rating: 63V; Termination: SMD/SMT; Fuse Current: 500mA; Working Voltage: 63V; Length: 3.18mm; Width: 0.06inch; Height: 0.023inch; Depth: 1.52mm; Radiation Hardening: No; RoHS Compliant: Yes; REACH SVHC: Unknown; Lead Free: Lead Free; ComponentLink1URL: https://datasheet.ciiva.com/17081/0466-500nr-17081083.pdf?src-supplier=Allied+Electronics; ComponentLink1Description: https://datasheet.ciiva.com/17081/0466-500nr-17081083.pdf?src-supplier=Allied+Electronics; ComponentLink2URL: https://datasheet.ciiva.com/16327/littelfuse-fuse-466-16327478.pdf?src-supplier=Future+Electronics; ComponentLink2Description: https://datasheet.ciiva.com/16327/littelfuse-fuse-466-16327478.pdf?src-supplier=Future+Electronics; ComponentLink3URL: https://datasheet.ciiva.com/299/466seriesdrawing-299207.pdf?src-supplier=Digi-Key; ComponentLink3Description: https://datasheet.ciiva.com/299/466seriesdrawing-299207.pdf?src-supplier=Digi-Key; ComponentLink4URL: https://datasheet.ciiva.com/299/466seriesdrawing-299208.pdf?src-supplier=Digi-Key; ComponentLink4Description: https://datasheet.ciiva.com/299/466seriesdrawing-299208.pdf?src-supplier=Digi-Key; ComponentLink5URL: https://datasheet.ciiva.com/299/466seriesdrawing-299209.pdf?src-supplier=Digi-Key; ComponentLink5Description: https://datasheet.ciiva.com/299/466seriesdrawing-299209.pdf?src-supplier=Digi-Key; ComponentLink6URL: https://datasheet.ciiva.com/14102/ei466-dat-e-14102891.pdf?src-supplier=Distrelec; ComponentLink6Description: https://datasheet.ciiva.com/14102/ei466-dat-e-14102891.pdf?src-supplier=Distrelec; ComponentLink7URL: https://datasheet.ciiva.com/15186/getdatasheetpartid-57351-15186924.pdf?src-supplier=Verical; ComponentLink7Description: https://datasheet.ciiva.com/15186/getdatasheetpartid-57351-15186924.pdf?src-supplier=Verical
Q2 = NX2301PVL: MOSFET 20V P-Channel 2A; Supplier 1: Mouser; Supplier Part Number 1: 771-NX2301PVL
R19-R22 = Resistor
  R20: Supplier 1: Mouser; Supplier Part Number 1: 603-AC0402FR-073K3L

## Sheet IsoSPI V0.1.SchDoc
size A4; SheetNumber: 9; SheetTotal: 9
Used 3 times, as channels IsoSPI 12S, IsoSPI 8S LHS, IsoSPI 8S RHS. Parts and nets are listed once, with the designators drawn on the sheet.
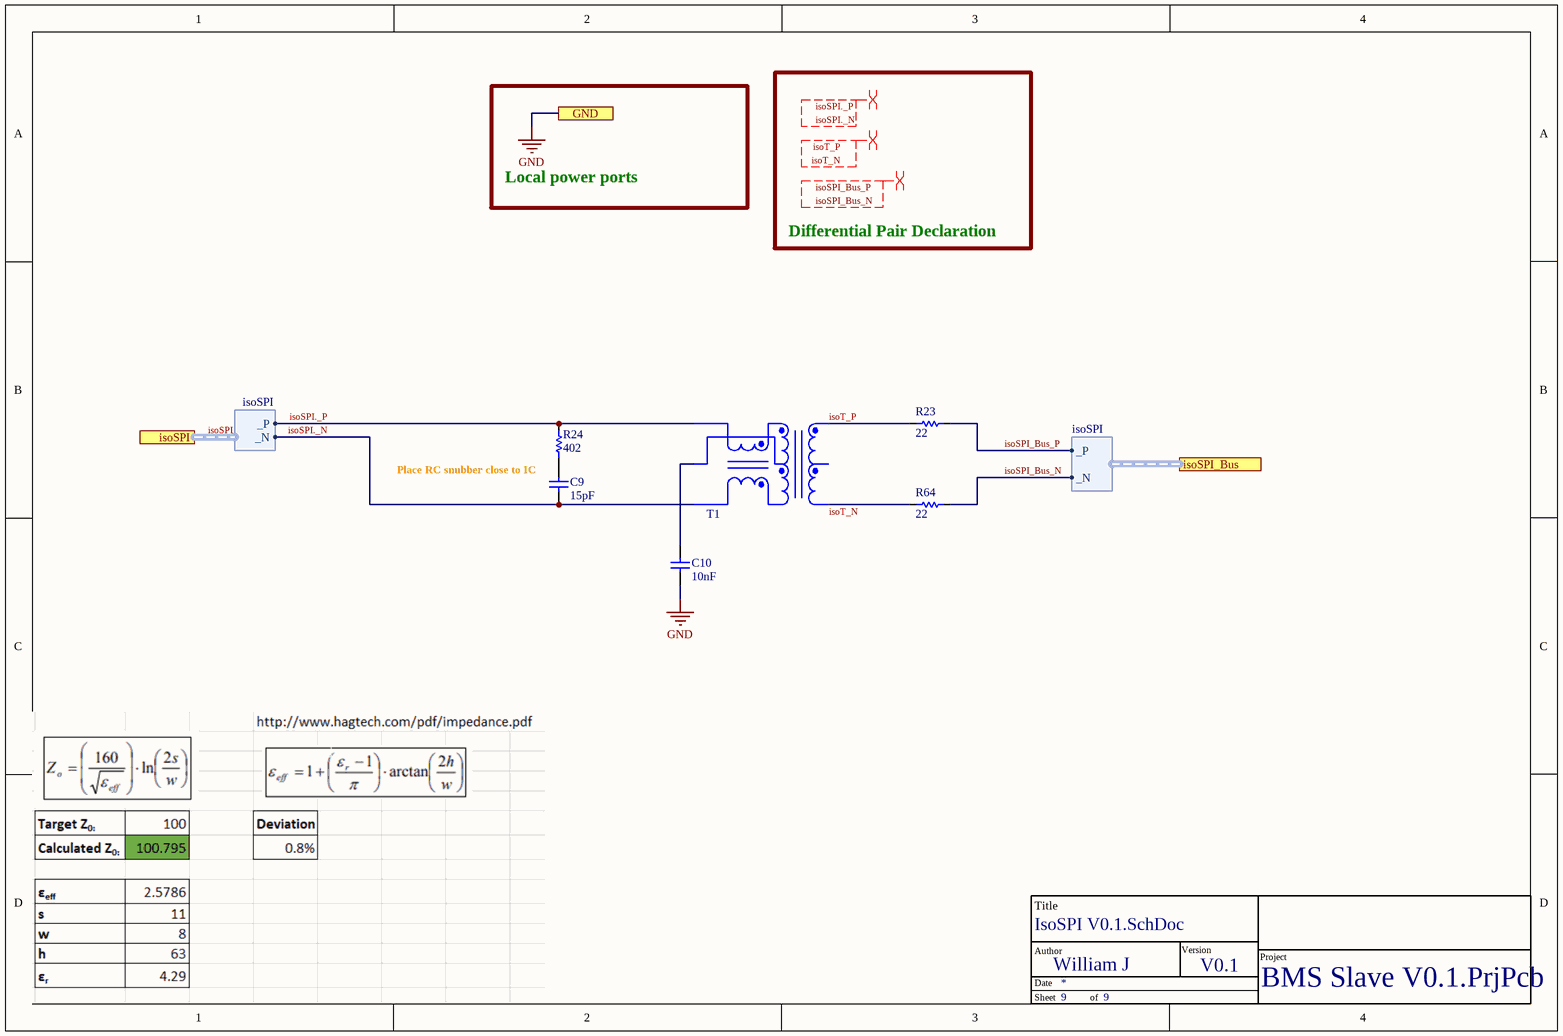
[diagram p3: IsoSPI V0.1.SchDoc]

### Parts
*  TitleBlock  (value not drawn)  (graphical)
C9  value 15pF  [C_0402]  (hidden comment: 885012005026)
C10  value 10nF  [C_0402]  (hidden comment: C1005X7S2A103K050BB)
R23  value 22  [R_0402]  (hidden comment: RC0402JR-1322RL)
R24  value 402  [R_0402]  (hidden comment: CRCW0402402RFKEDC)
R64  value 22  [R_0402]  (hidden comment: RC0402JR-1322RL)
T1  SM91502ALE  [SM91502ALE]  (value not drawn)

### Ports
GND, isoSPI (harness isoSPI), isoSPI_Bus (harness isoSPI)

### Harnesses
isoSPI: _P, _N

### Nets
GND: C10.1 ; port GND
isoSPI._N: C9.1 T1.4 ; port isoSPI._N
isoSPI._P: R24.2 T1.6 ; port isoSPI._P
isoSPI_Bus_N: R64.1 ; port isoSPI_Bus._N
isoSPI_Bus_P: R23.1 ; port isoSPI_Bus._P
isoT_N: R64.2 T1.3  [project net isoT_N_9]
isoT_P: R23.2 T1.1  [project net isoT_P_9]
NetC9_2: C9.2 R24.1
NetC10_2: C10.2 T1.5

Not connected (* = marked no-connect by the designer): T1 2

### Channels
IsoSPI 12S: designators end in _IsoSPI_12S; ports GND=GND_12
IsoSPI 8S LHS: designators end in _IsoSPI_8S_LHS; ports GND=GND_8L
IsoSPI 8S RHS: designators end in _IsoSPI_8S_RHS; ports GND=GND_8R

### Buses and harness runs
harness isoSPI = port isoSPI

### Layout directives
differential pair; differential pair class isoSPI_BUS: isoSPI_Bus_N, isoSPI_Bus_P, isoT_N, isoT_P
differential pair; differential pair class isoSPI: isoSPI._N, isoSPI._P

### Notes on the sheet
- Local power ports
- Differential Pair Declaration
- Place RC snubber close to IC
- Labels drawn without touching a wire or pin: isoSPI._N, isoSPI._P, isoSPI_Bus_N, isoSPI_Bus_P, isoT_N, isoT_P
- (in symbol TitleBlock) Title; Author; Version; Project; Date; Sheet; of

### Library data of the parts
C9 C10 = Capacitor: ComponentLink1Description: New link; ComponentLink1URL: *
  C9: Supplier 1: Mouser; Supplier Part Number 1: 710-885012005026
R23 R24 R64 = Resistor
  R24: Supplier 1: Mouser; Supplier Part Number 1: 71-CRCW0402-402-E3
T1 = SM91502ALE: BMS XFORMER 1-CH 1000V AECQ +125; Manufacturer: Bourns; Inductance: 150uH; Turns Ratio: 1:1; Supplier 1: RSComponents; Manufacturer Part Number: SM91502ALE; RoHS: Yes; Category: Transformers; Stock 1: 1; Pricing 1: 800=2.35100 (USD); Mount: Surface Mount; Min Operating Temperature: -40°C; Max Operating Temperature: 125°C; Packaging: Cut Tape; ComponentLink1URL: https://www.bourns.com/docs/Product-Datasheets/SM91502AL.pdf?src-supplier=Digi-Key; ComponentLink1Description: https://www.bourns.com/docs/Product-Datasheets/SM91502AL.pdf?src-supplier=Digi-Key; Supplier Part Number 1: 1802382

## Sheet Cell Monitor 8S LHS V0.1.SchDoc
size A4; SheetNumber: 4; SheetTotal: 9
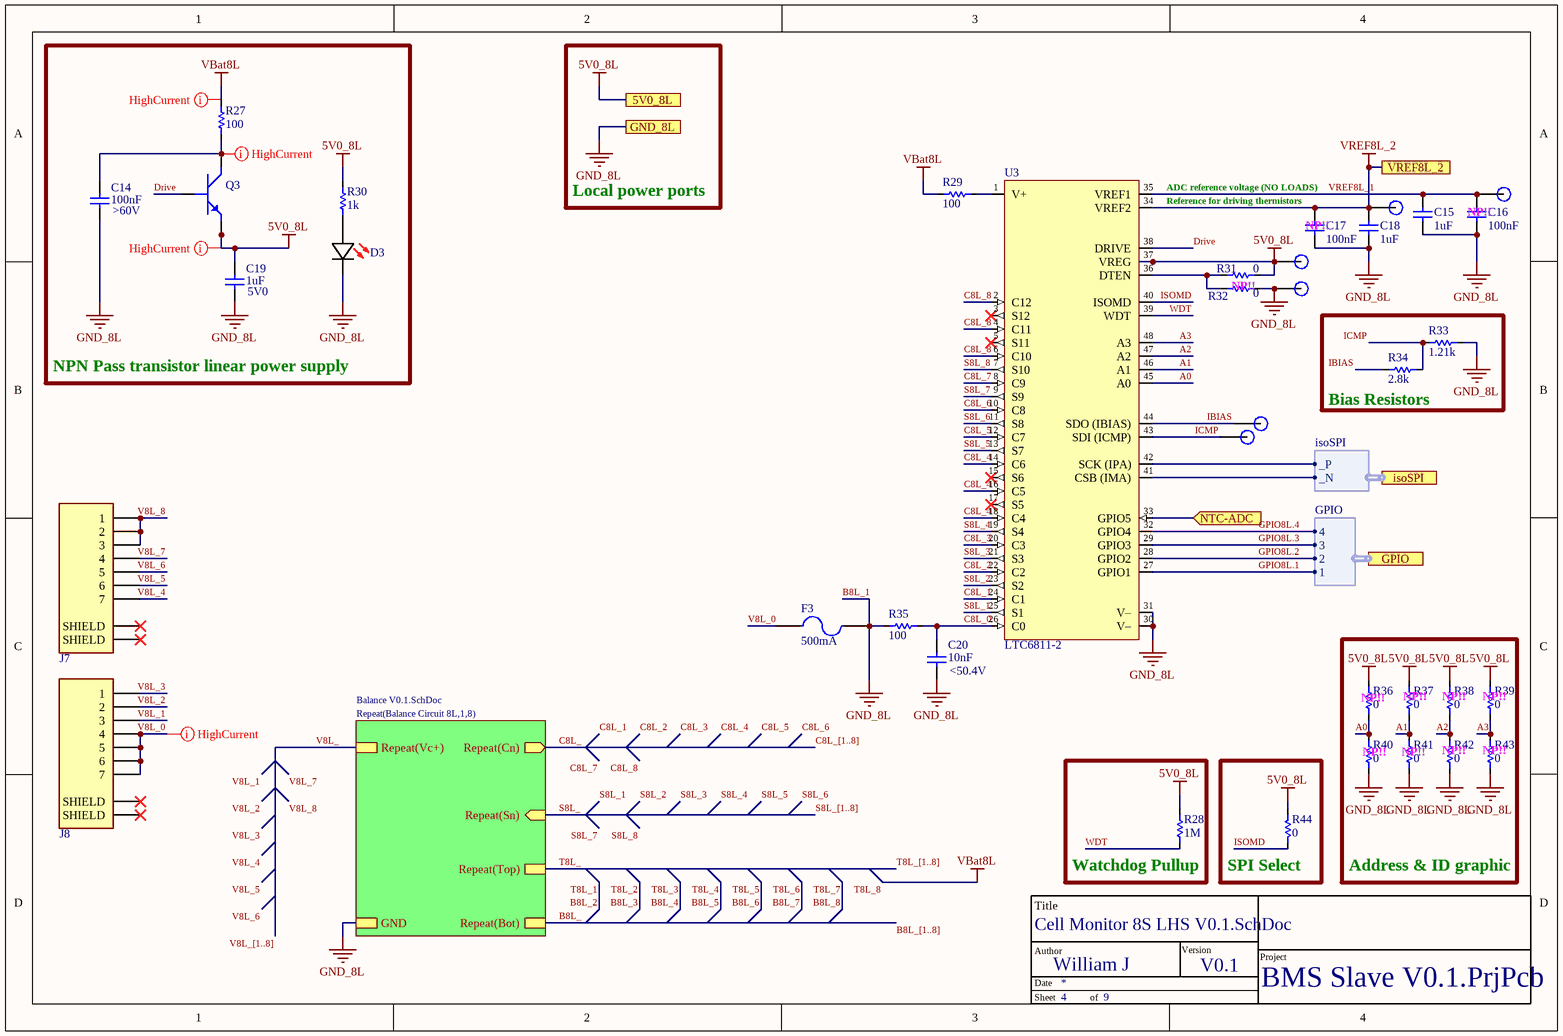
[diagram p4: Cell Monitor 8S LHS V0.1.SchDoc]

### Parts
(Parts that share a designator on the sheet are numbered #1, #2 ... from top to bottom, then left to right.)
*?#1  TitleBlock  (value not drawn)  (graphical)
C14  value 100nF  Voltage: >60V  [C_0402]  (hidden comment: GRM155R62A104KE14D)
C15  value 1uF  [C_0402]  (hidden comment: EMK105BJ105KV-F)
C16  value 100nF  [C_0402]  (hidden comment: GRM155R62A104KE14D)
C17  value 100nF  [C_0402]  (hidden comment: GRM155R62A104KE14D)
C18  value 1uF  [C_0402]  (hidden comment: EMK105BJ105KV-F)
C19  value 1uF  Voltage: 5V0  [C_0402]  (hidden comment: EMK105BJ105KV-F)
C20  value 10nF  Voltage: <50.4V  [C_0402]  (hidden comment: C1005X7S2A103K050BB)
D3  150060SS55040  [LED (0603)]  (value not drawn)
F3  Current Rating: 500mA  [0466.500NR]  (hidden comment: 0466.500NR)
J7  84953-7  [84953-7]  (value not drawn)
J8  84953-7  [84953-7]  (value not drawn)
NT3  NetTie  [NetTie]  (value not drawn)  (net tie, no BOM)
NT4  NetTie  [NetTie]  (value not drawn)  (net tie, no BOM)
Q3  PHPT60603NYX  [LFPAK56 (SOT669)]  (value not drawn)
R27  value 100  [R_2010]  (hidden comment: CRM2010-FX-1000ELF)
R28  value 1M  [R_0402]  (hidden comment: RC0402JR-071ML)
R29  value 100  [R_2010]  (hidden comment: CRM2010-FX-1000ELF)
R30  value 1k  [R_0402]  (hidden comment: RC0402FR-071KL)
R31  value 0  [R_0402]  (hidden comment: CR0402-J/-000GLF)
R32  value 0  [R_0402]  (hidden comment: CR0402-J/-000GLF)
R33  value 1.21k  [R_0402]  (hidden comment: CR0402-FX-1211GLF)
R34  value 2.8k  [R_0402]  (hidden comment: ERJ-2RKF2801X)
R35  value 100  [R_0402]  (hidden comment: RC0402FR-07100RL)
R36  value 0  [R_0402]  (hidden comment: CR0402-J/-000GLF)
R37  value 0  [R_0402]  (hidden comment: CR0402-J/-000GLF)
R38  value 0  [R_0402]  (hidden comment: CR0402-J/-000GLF)
R39  value 0  [R_0402]  (hidden comment: CR0402-J/-000GLF)
R40  value 0  [R_0402]  (hidden comment: CR0402-J/-000GLF)
R41  value 0  [R_0402]  (hidden comment: CR0402-J/-000GLF)
R42  value 0  [R_0402]  (hidden comment: CR0402-J/-000GLF)
R43  value 0  [R_0402]  (hidden comment: CR0402-J/-000GLF)
R44  value 0  [R_0402]  (hidden comment: CR0402-J/-000GLF)
TP8  VREF1  [Test Point]  (value not drawn)  (no BOM)
TP9  VREF2  [Test Point]  (value not drawn)  (no BOM)
TP10  5V0_8SL  [Test Point]  (value not drawn)  (no BOM)
TP11  IBIAS  [Test Point]  (value not drawn)  (no BOM)
TP12  ICMP  [Test Point]  (value not drawn)  (no BOM)
TP14  5V0_8R  [Test Point]  (value not drawn)  (no BOM)
U3  LTC6811-2  [SSOP50P780X200-48N]

### Blocks framed on the sheet
NPN Pass transistor linear power supply: C14 C19 D3 Q3 R27 R30
Bias Resistors: R33 R34
Address & ID graphic: R36-R43
Watchdog Pullup: R28
SPI Select: R44

### Sub-sheets
Repeat(Balance Circuit 8L,1,8) = Balance V0.1.SchDoc: Repeat(Bot), Repeat(Vc+), Repeat(Top), Repeat(Cn) (out), Repeat(Sn) (in), GND

### Ports
5V0_8L, GND_8L, GPIO (harness GPIO), isoSPI (harness isoSPI), NTC-ADC (in), VREF8L_2

### Harnesses
GPIO: 1, 2, 3, 4
isoSPI: _P, _N

### Nets
5V0_8L: C19.2 Q3.1(Emitter) Q3.2(Emitter) Q3.3(Emitter) R28.2 R30.2 R31.2 R36.2 R37.2 R38.2 R39.2 R44.2 TP10.1 U3.37(VREG) ; port 5V0_8L
GND_8L: C14.1 C15.1 C16.1 C17.1 C18.1 C19.1 C20.1 D3.1(K) F3.2 NT3.1 R32.1 R33.2 R35.1 R40.1 R41.1 R42.1 R43.1 TP14.1 U3.30(V–) U3.31(V–) ; port GND_8L, sheet Repeat(Balance Circuit 8L,1,8)/GND
VBat8L: NT4.2 R27.2 R29.2
VREF8L_2: C17.2 C18.2 TP9.1 U3.34(VREF2) ; port VREF8L_2
A0: R36.1 R40.2 U3.45(A0)  [project net A0_4]
A1: R37.1 R41.2 U3.46(A1)  [project net A1_4]
A2: R38.1 R42.2 U3.47(A2)  [project net A2_4]
A3: R39.1 R43.2 U3.48(A3)  [project net A3_4]
B8L_: sheet Repeat(Balance Circuit 8L,1,8)/Repeat(Bot)
B8L_1: NT3.2
C8L_: sheet Repeat(Balance Circuit 8L,1,8)/Repeat(Cn)
C8L_0: C20.2 R35.2 U3.26(C0)  [project net C8L_0_4]
C8L_1: U3.24(C1)
C8L_2: U3.22(C2)
C8L_3: U3.20(C3)
C8L_4: U3.14(C6) U3.16(C5) U3.18(C4)
C8L_5: U3.12(C7)
C8L_6: U3.10(C8)
C8L_7: U3.8(C9)
C8L_8: U3.2(C12) U3.4(C11) U3.6(C10)
Drive: Q3.4(Base) U3.38(DRIVE)  [project net Drive_4]
GPIO8L.1: U3.27(GPIO1) ; port GPIO.1
GPIO8L.2: U3.28(GPIO2) ; port GPIO.2
GPIO8L.3: U3.29(GPIO3) ; port GPIO.3
GPIO8L.4: U3.32(GPIO4) ; port GPIO.4
IBIAS: R34.1 TP11.1 U3.44(SDO_(IBIAS))  [project net IBIAS_4]
ICMP: R33.1 R34.2 TP12.1 U3.43(SDI_(ICMP))  [project net ICMP_4]
ISOMD: R44.1 U3.40(ISOMD)  [project net ISOMD_4]
isoSPI._N: U3.41(CSB_(IMA)) ; port isoSPI._N
isoSPI._P: U3.42(SCK_(IPA)) ; port isoSPI._P
S8L_: sheet Repeat(Balance Circuit 8L,1,8)/Repeat(Sn)
S8L_1: U3.25(S1)
S8L_2: U3.23(S2)
S8L_3: U3.21(S3)
S8L_4: U3.19(S4)
S8L_5: U3.13(S7)
S8L_6: U3.11(S8)
S8L_7: U3.9(S9)
S8L_8: U3.7(S10)
T8L_: sheet Repeat(Balance Circuit 8L,1,8)/Repeat(Top)
T8L_8: NT4.1
V8L_: sheet Repeat(Balance Circuit 8L,1,8)/Repeat(Vc+)
V8L_0: F3.1 J8.4 J8.5 J8.6 J8.7  [project net V8L_0_4]
V8L_1: J8.3
V8L_2: J8.2
V8L_3: J8.1
V8L_4: J7.7
V8L_5: J7.6
V8L_6: J7.5
V8L_7: J7.4
V8L_8: J7.1 J7.2 J7.3
VREF8L_1: C15.2 C16.2 TP8.1 U3.35(VREF1)  [project net VREF8L_1_4]
WDT: R28.1 U3.39(WDT)  [project net WDT_4]
NetC14_2: C14.2 Q3.5(Collector) R27.1
NetD3_2: D3.2(A) R30.1
NetR29_1: R29.1 U3.1(V+)
NetR31_1: R31.1 R32.2 U3.36(DTEN)
NetU2_Temperature_Sensing_8S_LHS_1: U3.33(GPIO5) ; port NTC-ADC

Not connected (* = marked no-connect by the designer): J7 S1(SHIELD)* S2(SHIELD)*; J8 S1(SHIELD)* S2(SHIELD)*; U3 3(S12)* 5(S11)* 15(S6)* 17(S5)*

### Buses and harness runs
bus B8L_[1..8]
bus C8L_[1..8]
bus S8L_[1..8]
bus T8L_[1..8]
bus V8L_[1..8]

### Layout directives
net class HighCurrent; Current: >50mA: 5V0_8L, NetC14_2, V8L_0_4, VBat8L

### Notes on the sheet
- Local power ports
- ADC reference voltage (NO LOADS)
- (near C17) Reference for driving thermistors
- (near C17) NP!!
- (near C16) NP!!
- (near R32) NP!!
- (near R36) NP!!
- (near R37) NP!!
- (near R38) NP!!
- (near R39) NP!!
- (near R40) NP!!
- (near R41) NP!!
- (near R42) NP!!
- (near R43) NP!!
- Labels drawn without touching a wire or pin: C8L_1, C8L_2, C8L_3, C8L_4, C8L_5, C8L_6, C8L_7, C8L_8, S8L_1, S8L_2, S8L_3, S8L_4, S8L_5, S8L_6, S8L_7, S8L_8, V8L_1, V8L_2, V8L_3, V8L_4, V8L_5, V8L_6, V8L_7, V8L_8
- (in symbol TitleBlock) Title; Author; Version; Project; Date; Sheet; of

### Library data of the parts
C14-C20 = Capacitor: ComponentLink1Description: New link; ComponentLink1URL: *
  C14 C16 C17: Manufacture Part Number 1: GRM155R62A104KE14D
D3 = 150060SS55040: as D1 on sheet Cell Monitor 12S V0.1; Supplier 1: Mouser; Manufacturer Part Number: 150060SS55040; RoHS: No; Category: LEDs; Stock 1: 17006; Pricing 1: 1=0.18000, 10=0.16800, 50=0.16800, 100=0.15200, 1000=0.12100, 10000=0.10600 (USD); Mount: Surface Mount; Case/Package: 0603; Color: Red; Case Code (Imperial): 0603; Case Code (Metric): 1608; Packaging: Tape and Reel; Lens Transparency: Diffused; Length: 1.6mm; Width: 0.8mm; Height: 0.5mm; RoHS Compliant: No; Supplier Part Number 1: 710-150060SS55040
F3 = Fuse 2: as F1 on sheet Cell Monitor 12S V0.1; Published: 8-Jun-2000; LatestRevisionDate: 17-Jul-2002; LatestRevisionNote: Re-released for DXP Platform.; PackageReference: PIN-W2/E2.8; Publisher: Altium Limited; PackageDescription: Thru-Hole; 2 Leads; Supplier 1: Mouser; Supplier Part Number 1: 576-0466.500NR; Manufacturer: Littelfuse; Manufacturer Part Number: 0466.500NR; RoHS: Yes; Category: Fuses; Stock 1: 36497; Pricing 1: 1=0.77000, 10=0.59200, 50=0.59200, 100=0.48900, 1000=0.41600, 10000=0.39000 (USD); Mount: Surface Mount; Case/Package: 1206; Number of Pins: 2; Case Code (Metric): 3216; Case Code (Imperial): 1206; Housing Material: Ceramic; Terminal Material: Copper; Min Operating Temperature: -55°C; Max Operating Temperature: 90°C; Packaging: Tape and Reel; Package Quantity: 5000; Voltage Rating (DC): 63V; Series: 466; Voltage Rating: 63V; Termination: SMD/SMT; Fuse Current: 500mA; Working Voltage: 63V; Length: 3.18mm; Width: 0.06inch; Height: 0.023inch; Depth: 1.52mm; Radiation Hardening: No; RoHS Compliant: Yes; REACH SVHC: Unknown; Lead Free: Lead Free; ComponentLink1URL: https://datasheet.ciiva.com/17081/0466-500nr-17081083.pdf?src-supplier=Allied+Electronics; ComponentLink1Description: https://datasheet.ciiva.com/17081/0466-500nr-17081083.pdf?src-supplier=Allied+Electronics; ComponentLink2URL: https://datasheet.ciiva.com/16327/littelfuse-fuse-466-16327478.pdf?src-supplier=Future+Electronics; ComponentLink2Description: https://datasheet.ciiva.com/16327/littelfuse-fuse-466-16327478.pdf?src-supplier=Future+Electronics; ComponentLink3URL: https://datasheet.ciiva.com/299/466seriesdrawing-299207.pdf?src-supplier=Digi-Key; ComponentLink3Description: https://datasheet.ciiva.com/299/466seriesdrawing-299207.pdf?src-supplier=Digi-Key; ComponentLink4URL: https://datasheet.ciiva.com/299/466seriesdrawing-299208.pdf?src-supplier=Digi-Key; ComponentLink4Description: https://datasheet.ciiva.com/299/466seriesdrawing-299208.pdf?src-supplier=Digi-Key; ComponentLink5URL: https://datasheet.ciiva.com/299/466seriesdrawing-299209.pdf?src-supplier=Digi-Key; ComponentLink5Description: https://datasheet.ciiva.com/299/466seriesdrawing-299209.pdf?src-supplier=Digi-Key; ComponentLink6URL: https://datasheet.ciiva.com/14102/ei466-dat-e-14102891.pdf?src-supplier=Distrelec; ComponentLink6Description: https://datasheet.ciiva.com/14102/ei466-dat-e-14102891.pdf?src-supplier=Distrelec; ComponentLink7URL: https://datasheet.ciiva.com/15186/getdatasheetpartid-57351-15186924.pdf?src-supplier=Verical; ComponentLink7Description: https://datasheet.ciiva.com/15186/getdatasheetpartid-57351-15186924.pdf?src-supplier=Verical
J7 J8 = 84953-7: as J1 on sheet Cell Monitor 12S V0.1; Supplier 1: Mouser; Manufacturer Part Number: 84953-7; RoHS: Yes; Category: FFC / FPC; Pricing 1: 1=0.96000, 10=0.78800, 50=0.78800, 100=0.68800, 500=0.59100, 1000=0.52600, 1500=0.47600, 4500=0.45900, 9000=0.43600, 10000=0.43600, 24000=0.42600 (USD); Mount: Surface Mount; Contact Material: Bronze; Contact Plating: Tin,Bright; Housing Color: Natural; Housing Material: Polymer; Min Operating Temperature: -40°C; Max Operating Temperature: 85°C; Termination: SMD/SMT; Package Quantity: 1500; Number of Rows: 1; Packaging: Tape and Reel; Orientation: Right Angle; Number of Positions: 7; Connector System: Flex-to-Board; PCB Mounting Orientation: Right Angle; Sealable: No (Without); Shrouded: Yes (With); Contact Current Rating: 1A; Max Voltage Rating (AC): 200V; Series: FPC; Length: 0.5866inch; Width: 0.2575inch; Height: 2.56mm; Depth: 7.3mm; Radiation Hardening: No; ELV: Compliant; REACH SVHC: Unknown; Flammability Rating: UL94 V-0; RoHS Compliant: Yes; ComponentLink1URL: https://datasheet.ciiva.com/669/eng-cd-84953-a3-669227.pdf?src-supplier=Digi-Key; ComponentLink1Description: https://datasheet.ciiva.com/669/eng-cd-84953-a3-669227.pdf?src-supplier=Digi-Key; ComponentLink2URL: https://datasheet.ciiva.com/669/eng-cd-84953-a3-669228.pdf?src-supplier=Digi-Key; ComponentLink2Description: https://datasheet.ciiva.com/669/eng-cd-84953-a3-669228.pdf?src-supplier=Digi-Key; ComponentLink3URL: https://datasheet.ciiva.com/30243/eng-ds-1-1773440-6-0506-30243340.pdf?src-supplier=Onlinecomponents.com; ComponentLink3Description: https://datasheet.ciiva.com/30243/eng-ds-1-1773440-6-0506-30243340.pdf?src-supplier=Onlinecomponents.com; ComponentLink4URL: https://datasheet.ciiva.com/16659/eng-ds-1-1773440-6-0506-16659033.pdf?src-supplier=Avnet+Europe; ComponentLink4Description: https://datasheet.ciiva.com/16659/eng-ds-1-1773440-6-0506-16659033.pdf?src-supplier=Avnet+Europe; ComponentLink5URL: https://datasheet.ciiva.com/669/eng-cd-84953-a3-669226.pdf?src-supplier=Digi-Key; ComponentLink5Description: https://datasheet.ciiva.com/669/eng-cd-84953-a3-669226.pdf?src-supplier=Digi-Key; ComponentLink6URL: https://datasheet.ciiva.com/15177/getdatasheetpartid-565061-15177031.pdf?src-supplier=Verical; ComponentLink6Description: https://datasheet.ciiva.com/15177/getdatasheetpartid-565061-15177031.pdf?src-supplier=Verical; ComponentLink7URL: https://datasheet.ciiva.com/10034/eng-ds-1-1773440-6-0506-10034350.pdf?src-supplier=Avnet; ComponentLink7Description: https://datasheet.ciiva.com/10034/eng-ds-1-1773440-6-0506-10034350.pdf?src-supplier=Avnet; Supplier Part Number 1: 571-84953-7
Q3 = PHPT60603NYX: as Q1 on sheet Cell Monitor 12S V0.1
R27-R44 = Resistor
TP8-TP12 TP14 = Test Point: 1.2mm Test point
U3 = LTC6811-2: as U1 on sheet Cell Monitor 12S V0.1